# Altium schematic sheet GateCircuit.SchDoc: Gate drive circuit
size A4; Author: Hildo Guillardi Júnior; Organization: UNICAMP / LCEE; Address1: University of Campinas - Brazil; Address2: Power Conditioning Laboratory; Address3: Licensed by GNU GPL 3.0; ProjectName: Easy Inverter
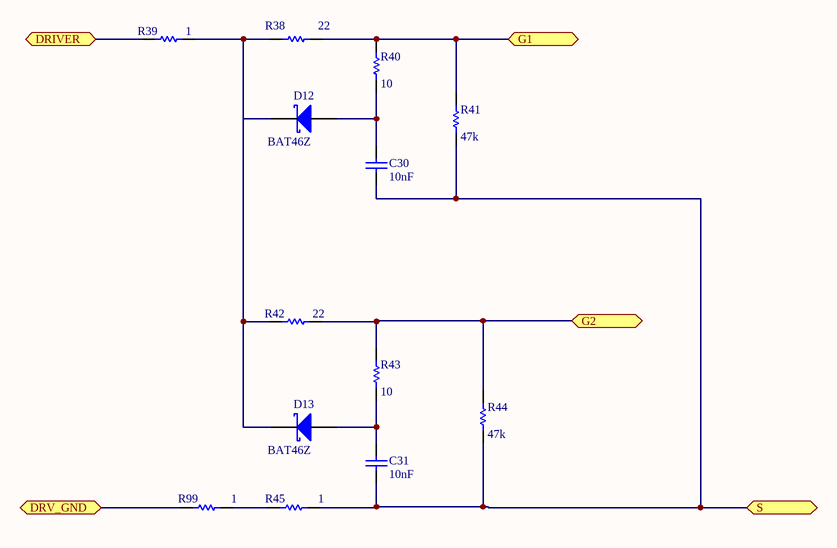
[diagram p0: GateCircuit.SchDoc]

## Parts
C30  value 10nF  [0805_W]
C31  value 10nF  [0805_W]
D12  value BAT46Z  [SOD-123]
D13  value BAT46Z  [SOD-123]
R38  value 22  [1210_W]
R39  value 1  [0805_W]
R40  value 10  [0805_W]
R41  value 47k  [0805_W]
R42  value 22  [1210_W]
R43  value 10  [0805_W]
R44  value 47k  [0805_W]
R45  value 1  [0805_W]
R99  value 1  [0805_W]

## Ports
DRIVER, DRV_GND, G1, G2, S

## Nets
DRIVER: R39.2 ; port DRIVER
DRV_GND: R99.2 ; port DRV_GND
G1: R38.1 R40.1 R41.1 ; port G1
G2: R42.1 R43.1 R44.1 ; port G2
S: C30.1 C31.1 R41.2 R44.2 R45.1 ; port S
NetC30_2: C30.2 D12.1(A) R40.2
NetC31_2: C31.2 D13.1(A) R43.2
NetD12_2: D12.2(K) D13.2(K) R38.2 R39.1 R42.2
NetR45_2: R45.2 R99.1

## Notes on the sheet
- Title
- Author
- Revisor
- Hildo G Jr
- Revision:
- Sheet
- of
- File:
- Size:
- A4
- HGJr

## Library data of the parts
C30 C31 = Cap_0805: Capacitor; Published: 8-Jun-2000; LatestRevisionDate: 17-Jul-2002; LatestRevisionNote: Re-released for DXP Platform.; PackageReference: RAD-0.3; Publisher: Altium Limited
D12 D13 = Schottky: Diodo Schottky; pn: BAT46ZFILM
R38-R45 R99 = Res_0805: Resistor; Manufacturer: Generic Components; Class: Passive; Published: 08/06/2000; Publisher: Altium Hobart Technology Centre; SubClass: Resistor